# Altium project 足底压力.PrjPcb
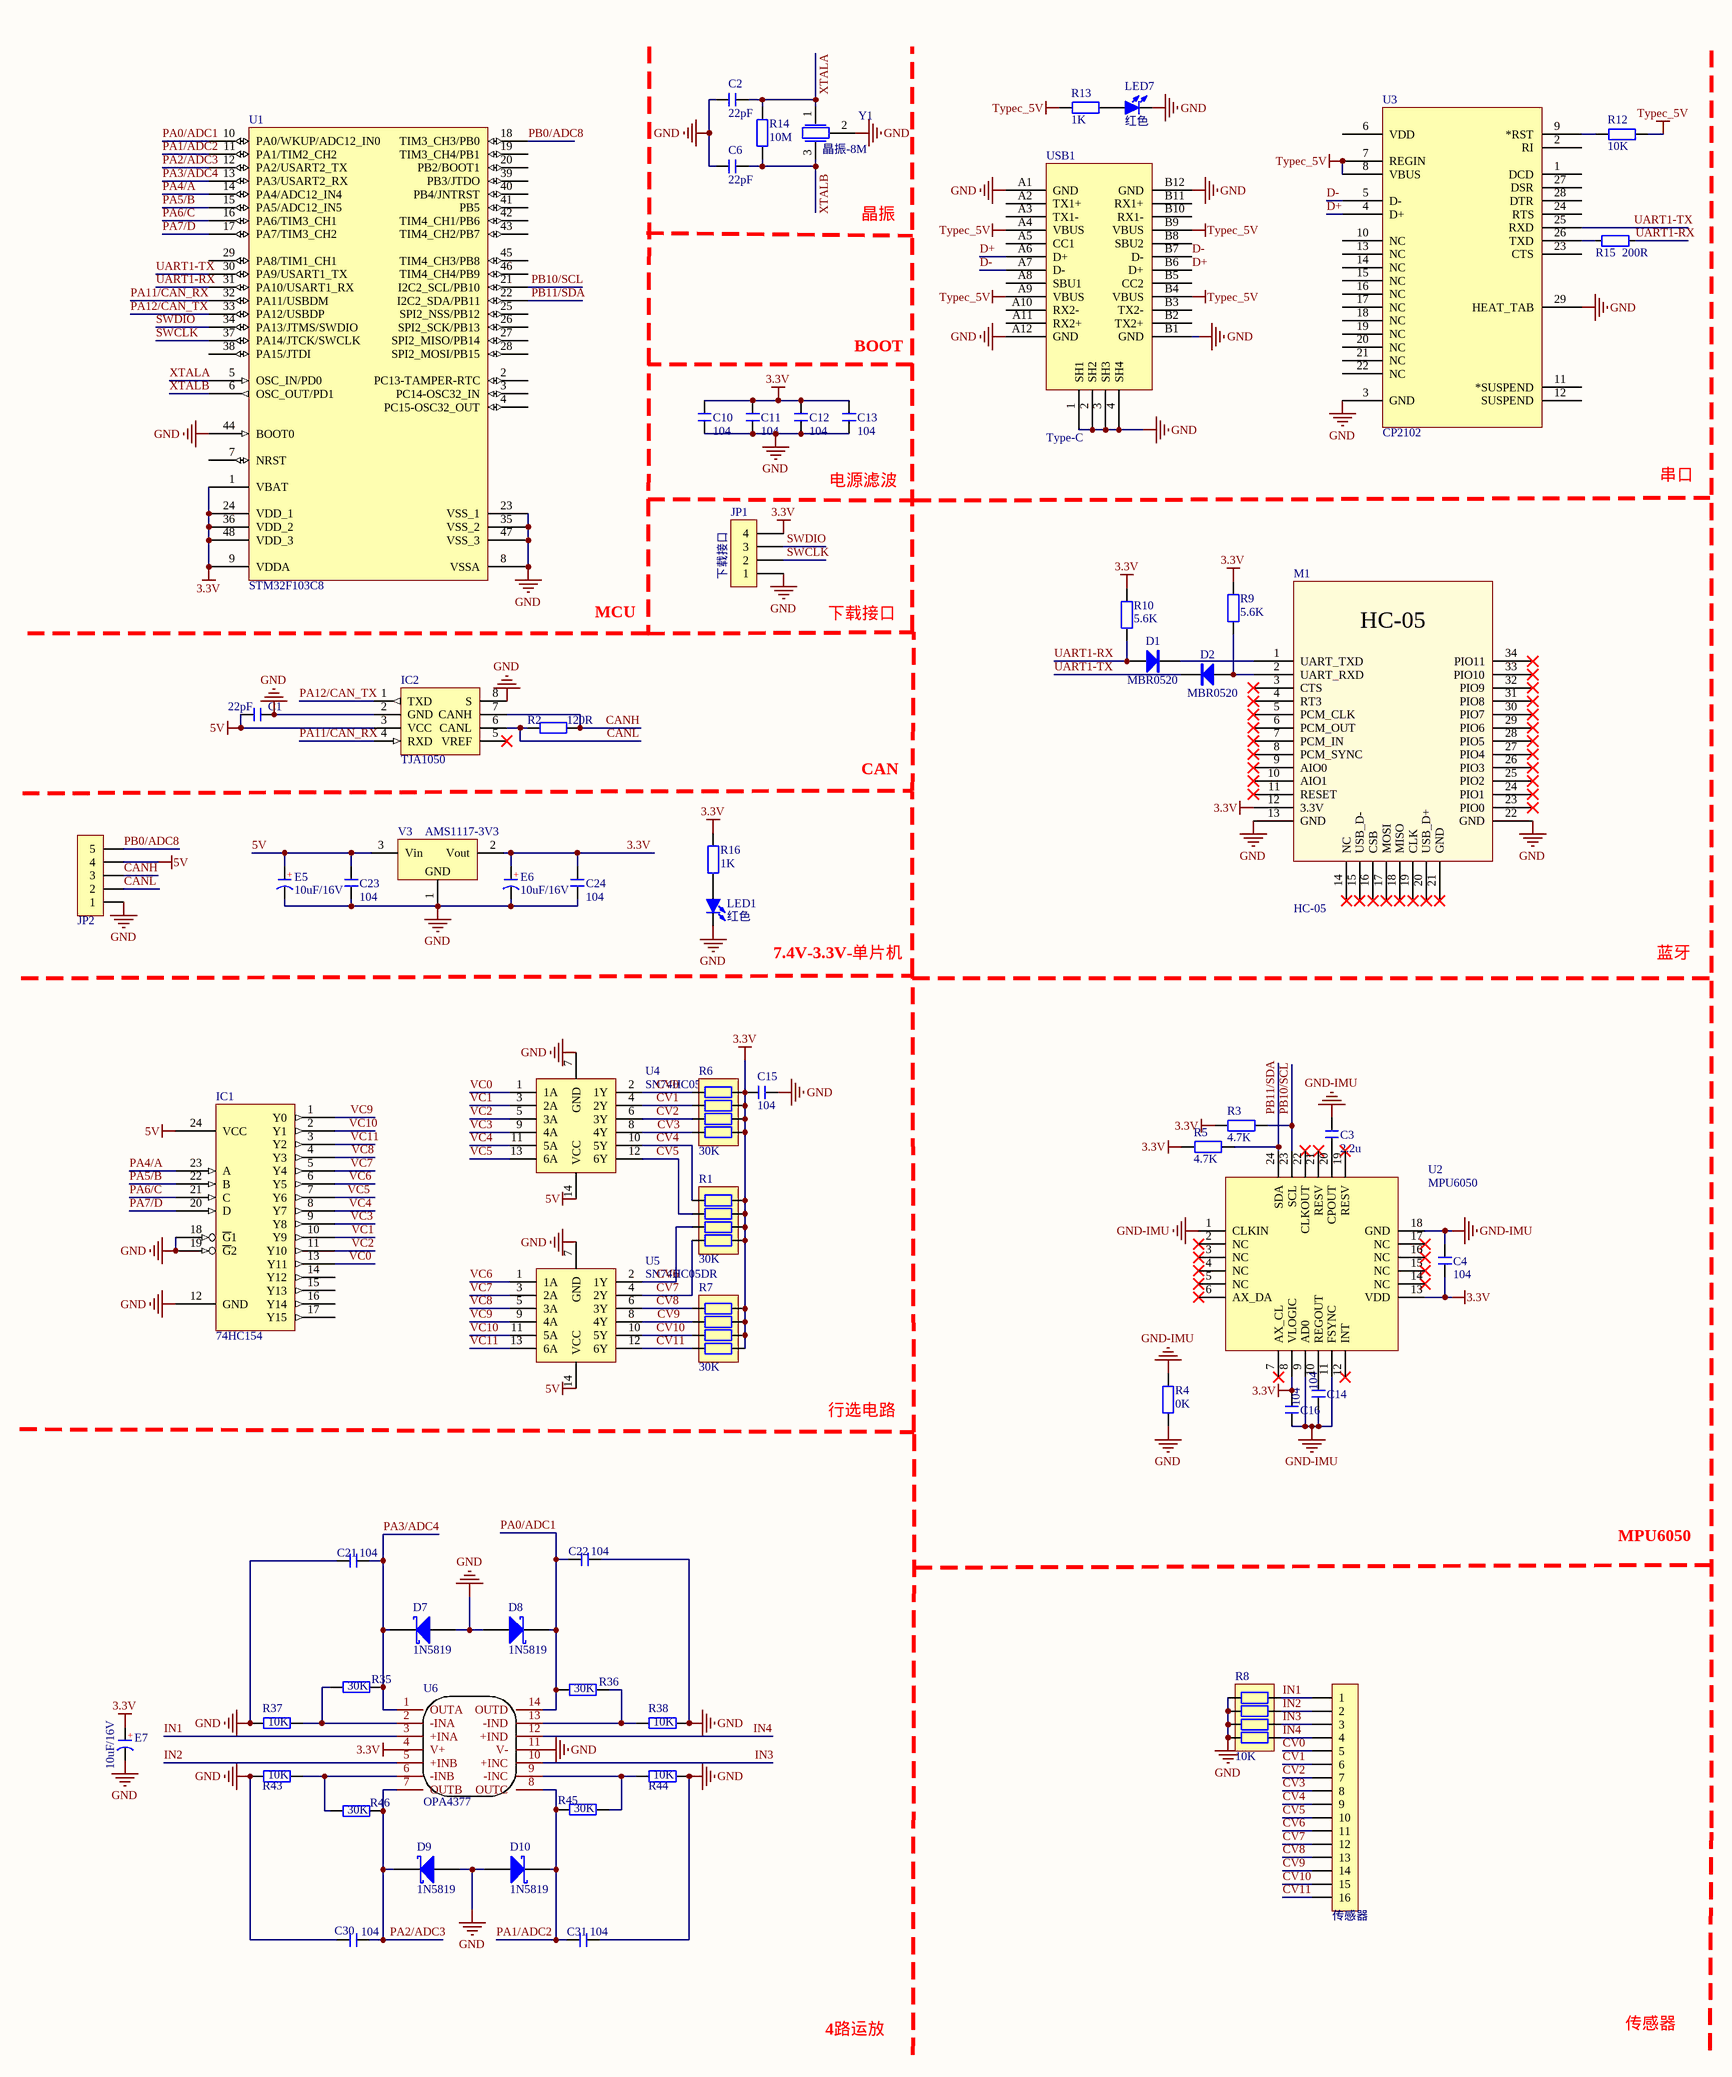
[diagram p0: 足底压力.SchDoc]
1 sheet, 67 parts. Net scope: global (net labels, ports and power ports of the same name join across sheets).
Board file: 足底压力.PcbDoc

## Sheet 足底压力.SchDoc
size A2

### Parts
C1  22pF  [C 0402_L]
C2  22pF  [C 0402_L]
C3  2.2u  [C 0402_L]
C4  104  [C 0402_L]
C6  22pF  [C 0402_L]
C10  104  [C 0402_L]
C11  104  [C 0402_L]
C12  104  [C 0402_L]
C13  104  [C 0402_L]
C14  104  [C 0402_L]
C15  104  [C 0402_L]
C16  104  [C 0402_L]
C21  104  [C 0402_L]
C22  104  [C 0402_L]
C23  104  [C 0402_L]
C24  104  [C 0402_L]
C30  104  [C 0402_L]
C31  104  [C 0402_L]
D1  MBR0520  [SOD-123]
D2  MBR0520  [SOD-123]
D7  1N5819  [SOD-123]
D8  1N5819  [SOD-123]
D9  1N5819  [SOD-123]
D10  1N5819  [SOD-123]
E5  10uF/16V  [CD A(3216)]
E6  10uF/16V  [CD A(3216)]
E7  10uF/16V  [CD A(3216)]
IC1  74HC154  [SOP24_N]
IC2  TJA1050  [SOP8_L]
JP1  下载接口  [下载接口]
JP2  HDR-1X5  [HDR2.54-M-LI-5P]  (value not drawn)
LED1  红色  [LED 0603R]
LED7  红色  [LED 0603R]
M1  HC-05  [HC-05]
R1  30K  [RCA-8P4R-0603]
R2  120R  [R 0402_L]
R3  4.7K  [R 0402_L]
R4  0K  [R 0402_L]
R5  4.7K  [R 0402_L]
R6  30K  [RCA-8P4R-0603]
R7  30K  [RCA-8P4R-0603]
R8  10K  [RCA-8P4R-0603]
R9  5.6K  [R 0402_L]
R10  5.6K  [R 0402_L]
R12  10K  [R 0402_L]
R13  1K  [R 0402_L]
R14  10M  [R 0402_L]
R15  200R  [RES_0402]
R16  1K  [R 0402_L]
R35  30K  [R 0402_L]
R36  30K  [R 0402_L]
R37  10K  [R 0402_L]
R38  10K  [R 0402_L]
R43  10K  [R 0402_L]
R44  10K  [R 0402_L]
R45  30K  [R 0402_L]
R46  30K  [R 0402_L]
U1  STM32F103C8  [LQFP48 7X7_L]
U2  MPU6050  [QFN24 4x4_L]
U3  CP2102  [QFN-28]
U4  SN74HC05DR  [SOP14]
U5  SN74HC05DR  [SOP14]
U6  OPA4377  [TSSOP14_L]
USB1  Type-C  [USB-C-SMD_16P]
V3  AMS1117-3V3  [SOT223_L]
Y1  晶振-8M  [XTAL3*7]
传感器  HDR-1X16  [XH2.54-WI-16P]  (value not drawn)

### Nets
3.3V: C4.1 C10.2 C11.2 C12.2 C13.2 C15.1 C16.2 C24.2 E6.1(A) E7.1(A) JP1.4 M1.12(3.3V) R1.5 R1.6 R1.7 R1.8 R3.1 R5.1 R6.5 R6.6 R6.7 R6.8 R7.5 R7.6 R7.7 R7.8 R9.2 R10.2 R16.2 U1.1(VBAT) U1.9(VDDA) U1.24(VDD_1) U1.36(VDD_2) U1.48(VDD_3) U2.8(VLOGIC) U2.13(VDD) U6.4(V+) V3.2(Vout)
5V: C1.2 C23.2 E5.1(A) IC1.24(VCC) IC2.3(VCC) JP2.4 U4.14(VCC) U5.14(VCC) V3.3(Vin)
GND: C1.1 C2.1 C6.1 C10.1 C11.1 C12.1 C13.1 C15.2 C21.1 C22.2 C23.1 C24.1 C30.2 C31.2 D7.1(A) D8.1(A) D9.1(A) D10.1(A) E5.2(K) E6.2(K) E7.2(K) IC1.12(GND) IC1.18(~{G}1) IC1.19(~{G}2) IC2.2(GND) IC2.8(S) JP1.1 JP2.1 LED1.2(K) LED7.2(K) M1.13(GND) M1.22(GND) R4.1 R8.1 R8.2 R8.3 R8.4 R37.2 R38.1 R43.1 R44.2 U1.8(VSSA) U1.23(VSS_1) U1.35(VSS_2) U1.44(BOOT0) U1.47(VSS_3) U3.3(GND) U3.29(HEAT_TAB) U4.7(GND) U5.7(GND) U6.11(V-) USB1.1(SH1) USB1.2(SH2) USB1.3(SH3) USB1.4(SH4) USB1.A1(GND) USB1.A12(GND) USB1.B1(GND) USB1.B12(GND) V3.1(GND) Y1.2
GND-IMU: C3.1 C4.2 C14.1 C16.1 R4.2 U2.1(CLKIN) U2.9(AD0) U2.11(FSYNC) U2.18(GND)
Typec_5V: R12.1 R13.2 U3.7(REGIN) U3.8(VBUS) USB1.A4(VBUS) USB1.A9(VBUS) USB1.B4(VBUS) USB1.B9(VBUS)
CANH: IC2.7(CANH) JP2.3 R2.1
CANL: IC2.6(CANL) JP2.2 R2.2
CV0: R6.1 U4.2(1Y) 传感器.5
CV1: R6.2 U4.4(2Y) 传感器.6
CV2: R6.3 U4.6(3Y) 传感器.7
CV3: R6.4 U4.8(4Y) 传感器.8
CV4: R1.1 U4.10(5Y) 传感器.9
CV5: R1.2 U4.12(6Y) 传感器.10
CV6: R1.3 U5.2(1Y) 传感器.11
CV7: R1.4 U5.4(2Y) 传感器.12
CV8: R7.1 U5.6(3Y) 传感器.13
CV9: R7.2 U5.8(4Y) 传感器.14
CV10: R7.3 U5.10(5Y) 传感器.15
CV11: R7.4 U5.12(6Y) 传感器.16
D+: U3.4(D+) USB1.A6(D+) USB1.B6(D+)
D-: U3.5(D-) USB1.A7(D-) USB1.B7(D-)
IN1: R8.5 U6.3(+INA) 传感器.1
IN2: R8.6 U6.5(+INB) 传感器.2
IN3: R8.7 U6.10(+INC) 传感器.3
IN4: R8.8 U6.12(+IND) 传感器.4
PA0/ADC1: C22.1 D8.2(K) R36.1 U1.10(PA0/WKUP/ADC12_IN0) U6.14(OUTD)
PA1/ADC2: C31.1 D10.2(K) R45.1 U1.11(PA1/TIM2_CH2) U6.8(OUTC)
PA2/ADC3: C30.1 D9.2(K) R46.2 U1.12(PA2/USART2_TX) U6.7(OUTB)
PA3/ADC4: C21.2 D7.2(K) R35.2 U1.13(PA3/USART2_RX) U6.1(OUTA)
PA4/A: IC1.23(A) U1.14(PA4/ADC12_IN4)
PA5/B: IC1.22(B) U1.15(PA5/ADC12_IN5)
PA6/C: IC1.21(C) U1.16(PA6/TIM3_CH1)
PA7/D: IC1.20(D) U1.17(PA7/TIM3_CH2)
PA11/CAN_RX: IC2.4(RXD) U1.32(PA11/USBDM)
PA12/CAN_TX: IC2.1(TXD) U1.33(PA12/USBDP)
PB0/ADC8: JP2.5 U1.18(TIM3_CH3/PB0)
PB10/SCL: R3.2 U1.21(I2C2_SCL/PB10) U2.23(SCL)
PB11/SDA: R5.2 U1.22(I2C2_SDA/PB11) U2.24(SDA)
SWCLK: JP1.2 U1.37(PA14/JTCK/SWCLK)
SWDIO: JP1.3 U1.34(PA13/JTMS/SWDIO)
UART1-RX: D1.1(A) R10.1 R15.1 U1.31(PA10/USART1_RX)
UART1-TX: D2.2(K) U1.30(PA9/USART1_TX) U3.25(RXD)
VC0: IC1.13(Y11) U4.1(1A)
VC1: IC1.10(Y9) U4.3(2A)
VC2: IC1.11(Y10) U4.5(3A)
VC3: IC1.9(Y8) U4.9(4A)
VC4: IC1.8(Y7) U4.11(5A)
VC5: IC1.7(Y6) U4.13(6A)
VC6: IC1.6(Y5) U5.1(1A)
VC7: IC1.5(Y4) U5.3(2A)
VC8: IC1.4(Y3) U5.5(3A)
VC9: IC1.1(Y0) U5.9(4A)
VC10: IC1.2(Y1) U5.11(5A)
VC11: IC1.3(Y2) U5.13(6A)
XTALA: C2.2 R14.1 U1.5(OSC_IN/PD0) Y1.1
XTALB: C6.2 R14.2 U1.6(OSC_OUT/PD1) Y1.3
NetC3_2: C3.2 U2.20(CPOUT)
NetC14_2: C14.2 U2.10(REGOUT)
NetD1_2: D1.2(K) M1.1(UART_TXD)
NetD2_1: D2.1(A) M1.2(UART_RXD) R9.1
NetLED1_1: LED1.1(A) R16.1
NetLED7_1: LED7.1(A) R13.1
NetR12_2: R12.2 U3.9(*RST)
NetR15_2: R15.2 U3.26(TXD)
NetR35_1: R35.1 R37.1 U6.2(-INA)
NetR36_2: R36.2 R38.2 U6.13(-IND)
NetR43_2: R43.2 R46.1 U6.6(-INB)
NetR44_1: R44.1 R45.2 U6.9(-INC)

Not connected (* = marked no-connect by the designer): IC1 14(Y12) 15(Y13) 16(Y14) 17(Y15); IC2 5(VREF)*; M1 3(CTS)* 4(RT3)* 5(PCM_CLK)* 6(PCM_OUT)* 7(PCM_IN)* 8(PCM_SYNC)* 9(AIO0)* 10(AIO1)* 11(RESET)* 14(NC)* 15(USB_D-)* 16(CSB)* 17(MOSI)* 18(MISO)* 19(CLK)* 20(USB_D+)* 21(GND)* 23(PIO0)* 24(PIO1)* 25(PIO2)* 26(PIO3)* 27(PIO4)* 28(PIO5)* 29(PIO6)* 30(PIO7)* 31(PIO8)* 32(PIO9)* 33(PIO10)* 34(PIO11)*; U1 2(PC13-TAMPER-RTC) 3(PC14-OSC32_IN) 4(PC15-OSC32_OUT) 7(NRST) 19(TIM3_CH4/PB1) 20(PB2/BOOT1) 25(SPI2_NSS/PB12) 26(SPI2_SCK/PB13) 27(SPI2_MISO/PB14) 28(SPI2_MOSI/PB15) 29(PA8/TIM1_CH1) 38(PA15/JTDI) 39(PB3/JTDO) 40(PB4/JNTRST) 41(PB5) 42(TIM4_CH1/PB6) 43(TIM4_CH2/PB7) 45(TIM4_CH3/PB8) 46(TIM4_CH4/PB9); U2 2(NC)* 3(NC)* 4(NC)* 5(NC)* 6(AX_DA)* 7(AX_CL)* 12(INT)* 14(NC)* 15(NC)* 16(NC)* 17(NC)* 19(RESV)* 21(RESV)* 22(CLKOUT)*; U3 1(DCD) 2(RI) 6(VDD) 10(NC) 11(*SUSPEND) 12(SUSPEND) 13(NC) 14(NC) 15(NC) 16(NC) 17(NC) 18(NC) 19(NC) 20(NC) 21(NC) 22(NC) 23(CTS) 24(RTS) 27(DSR) 28(DTR); USB1 A2(TX1+) A3(TX1-) A5(CC1) A8(SBU1) A10(RX2-) A11(RX2+) B2(TX2+) B3(TX2-) B5(CC2) B8(SBU2) B10(RX1-) B11(RX1+)

### Notes on the sheet
- 晶振
- BOOT
- 电源滤波
- 串口
- MCU
- 下载接口
- CAN
- 7.4V-3.3V-单片机
- 蓝牙
- 行选电路
- MPU6050
- 4路运放
- 传感器
- (in symbol CT) +

### Library data of the parts
C1-C4 C6 C10-C16 C21-C24 C30 C31 = C: 贴片电容; BOM名称: 无极性贴片电容; 淘宝ID: 封装库来自淘宝 ID：黄晶宝石; 联系售后，技术支持: https://shop463601444.taobao.com; 唯一出售店铺网址: https://shop463601444.taobao.com
D1 D2 = 1N4007: 整流二极管; 淘宝ID: 封装库来自淘宝 ID：黄晶宝石; 封装库来自淘宝卖家 ID：黄晶宝石: 其他店铺购入均为盗版，不享受售后技术支持服务，请立即申请退款; BOM名称: 整流二极管; 联系售后，技术支持: https://shop463601444.taobao.com
D7-D10 = 1N5819: 肖特基二极管; 淘宝ID: 封装库来自淘宝 ID：黄晶宝石; 属性: 40V/2A; BOM名称: 肖特基二极管; 欢迎光临: https://shop463601444.taobao.com
E5-E7 = CT: 贴片钽电容; 淘宝ID: 封装库来自淘宝 ID：黄晶宝石; BOM名称: 贴片钽电容; 联系售后: https://shop463601444.taobao.com
IC1 = 74HC154: 4线转16线译码器; 版权归属: 源创客; BOM名称: 4线转16线译码器; 学习资源: www.ooocke.com
IC2 = TJA1050: CAN总线收发芯片; 版权归属: 封装库来自淘宝 ID：黄晶宝石; BOM名称: CAN总线收发芯片; 学习资源: https://shop463601444.taobao.com
JP1 = 下载接口: Jlink下载接口
JP2 = Header 5: 5P接插件; 版权归属: 封装库来自淘宝 ID：黄晶宝石; System: Connector; BOM名称: 5P接插件; 学习资源: https://shop463601444.taobao.com
LED1 LED7 = LED-SMD: 贴片LED; 版权归属: 封装库来自淘宝 ID：黄晶宝石; BOM名称: 贴片LED; 学习资源: https://shop463601444.taobao.com
M1 = HC-05: 串口蓝牙模块; 版权归属: 源创客; BOM名称: 串口蓝牙模块; 学习资源: www.ooocke.com
R1 R6-R8 = R-8P4R: 贴片排阻; BOM名称: 贴片网络排阻; 版权归属: 封装库来自淘宝 ID：黄晶宝石; 联系售后: https://shop463601444.taobao.com
R2-R5 R9 R10 R12-R14 R16 R35-R38 R43-R46 = R: 贴片电阻; 版权归属: 来自淘宝 ID：黄晶宝石; 封装库来自淘宝卖家 ID：黄晶宝石: 其他店铺购入均为盗版，不享受售后技术支持服务，请立即申请退款; BOM名称: 贴片电阻; 联系售后: https://shop463601444.taobao.com
R15 = 电阻-0402: Resistor; Value: 22R
U1 = STM32F103C8: Flaah:64/RAM:20/IO:36; BOM名称: 32位STM单片机; 版权归属: 源创客; 学习资源: www.ooocke.com
U2 = MPU6050: 数字运动传感器; 版权归属: 源创客; BOM名称: 数字运动传感器; 学习资源: www.ooocke.com
U3 = CP2102: USB转TTL; PART DESC: SINGLE-CHIP USB TO UART BRIDGE, QFN28, RoHS.; MFG #1: SILICON LABS; PART NUMBER: CP2102; Value: Value; RefDes: RefDes; Type: DEV
U6 = OPA4377: 4路运放
USB1 = USB-Type-C-TOP
V3 = AMS1117: 三端稳压芯片; BOM名称: 稳压芯片; 淘宝ID: 封装库来自淘宝 ID：黄晶宝石; 欢迎光临淘宝店铺: https://shop463601444.taobao.com
Y1 = XTAL-3P
传感器 = Header 16: 16P接插件; 版权归属: 封装库来自淘宝卖家 ID：黄晶宝石; BOM名称: 16P接插件; 学习资源: https://shop463601444.taobao.com